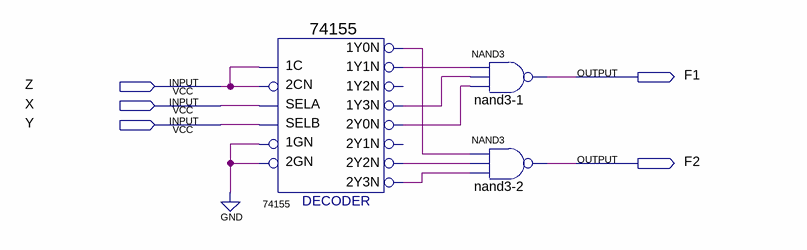
[diagram p0: schematic sheet]
// Quartus schematic Question1p3.bdf as structural Verilog: 3 symbols, 5 pins
module Question1p3 (
  input  Z,
  input  X,
  input  Y,
  output F1,
  output F2
);

  wire n74155_1y0n, n74155_1y1n, n74155_1y3n, n74155_2y0n, n74155_2y2n, n74155_2y3n;

  \74155  u_74155 (
    .\1C (Z), .\2CN (Z), .SELB(Y), .SELA(X), .\1GN (1'b0), .\2GN (1'b0), .\1Y1N (n74155_1y1n),
    .\1Y0N (n74155_1y0n), .\2Y0N (n74155_2y0n), .\1Y3N (n74155_1y3n), .\2Y3N (n74155_2y3n),
    .\2Y2N (n74155_2y2n));  // open: 1Y2N, 2Y1N
  nand \nand3-1  (F1, n74155_1y1n, n74155_1y3n, n74155_2y0n);
  nand \nand3-2  (F2, n74155_1y0n, n74155_2y2n, n74155_2y3n);
endmodule
